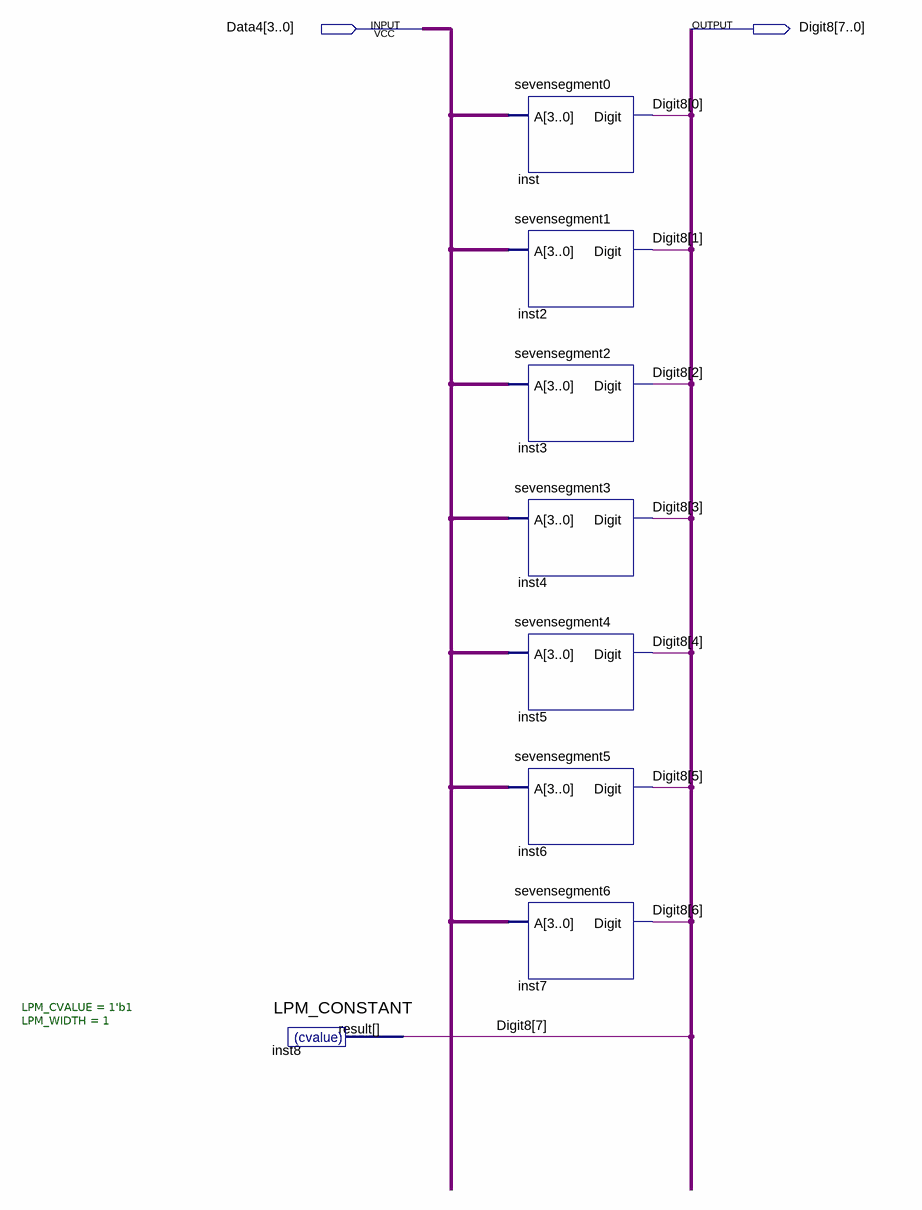
[diagram p0: schematic sheet]
// Quartus schematic sevensegmentdecodernopindp.bdf as structural Verilog: 8 symbols, 2 pins
module sevensegmentdecodernopindp (
  input  [3:0] Data4,
  output [7:0] Digit8
);

  LPM_CONSTANT #(.LPM_CVALUE(1'b1), .LPM_WIDTH(1)) inst8 (.result(Digit8[7]));
  sevensegment0 inst (.A(Data4), .Digit(Digit8[0]));
  sevensegment1 inst2 (.A(Data4), .Digit(Digit8[1]));
  sevensegment2 inst3 (.A(Data4), .Digit(Digit8[2]));
  sevensegment3 inst4 (.A(Data4), .Digit(Digit8[3]));
  sevensegment4 inst5 (.A(Data4), .Digit(Digit8[4]));
  sevensegment5 inst6 (.A(Data4), .Digit(Digit8[5]));
  sevensegment6 inst7 (.A(Data4), .Digit(Digit8[6]));
endmodule
